# EAGLE schematic assembly_smt_test (EAGLE 9.6.2)
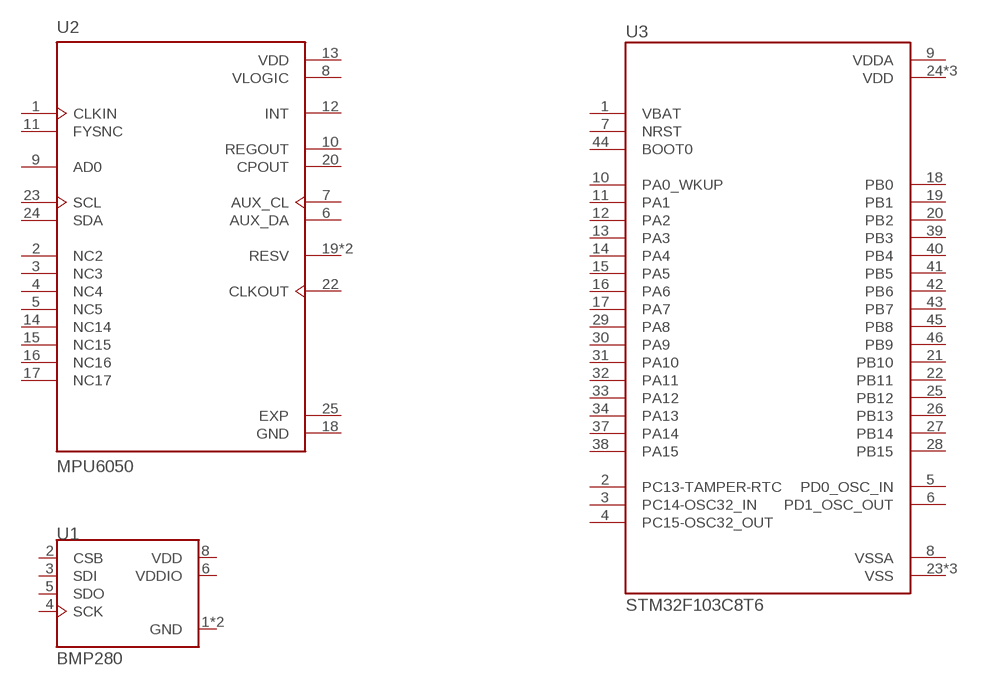
[diagram p0: schematic, sheet 1]

## Parts
U1  BMP280  [XDCR_BMP280]
U2  MPU6050  [IC_MPU6050]
U3  STM32F103C8T6  [QFP50P900X900X160-48N]
Unconnected: U1.2(CSB) U1.3(SDI) U1.4(SCK) U1.5(SDO) U2.1(CLKIN) U2.2(NC2) U2.3(NC3) U2.4(NC4) U2.5(NC5) U2.6(AUX_DA) U2.7(AUX_CL) U2.9(AD0) U2.10(REGOUT) U2.11(FYSNC) U2.12(INT) U2.14(NC14) U2.15(NC15) U2.16(NC16) U2.17(NC17) U2.19(RESV) U2.20(CPOUT) U2.21(RESV) U2.22(CLKOUT) U2.23(SCL) U2.24(SDA) U3.1(VBAT) U3.2(PC13-TAMPER-RTC) U3.3(PC14-OSC32_IN) U3.4(PC15-OSC32_OUT) U3.5(PD0_OSC_IN) U3.6(PD1_OSC_OUT) U3.7(NRST) U3.10(PA0_WKUP) U3.11(PA1) U3.12(PA2) U3.13(PA3) U3.14(PA4) U3.15(PA5) U3.16(PA6) U3.17(PA7) U3.18(PB0) U3.19(PB1) U3.20(PB2) U3.21(PB10) U3.22(PB11) U3.25(PB12) U3.26(PB13) U3.27(PB14) U3.28(PB15) U3.29(PA8) U3.30(PA9) U3.31(PA10) U3.32(PA11) U3.33(PA12) U3.34(PA13) U3.37(PA14) U3.38(PA15) U3.39(PB3) U3.40(PB4) U3.41(PB5) U3.42(PB6) U3.43(PB7) U3.44(BOOT0) U3.45(PB8) U3.46(PB9)

## Power pins joined to a net without a drawn wire
EXP: U2.25(EXP)
GND: U1.1(GND) U1.7(GND) U2.18(GND)
VDD: U1.8(VDD) U2.13(VDD) U3.24(VDD) U3.36(VDD) U3.48(VDD)
VDDA: U3.9(VDDA)
VDDIO: U1.6(VDDIO)
VLOGIC: U2.8(VLOGIC)
VSS: U3.23(VSS) U3.35(VSS) U3.47(VSS)
VSSA: U3.8(VSSA)

## Library data of the parts
U1 = BMP280:BMP280: BMP280 Absolute Barometric Pressure Sensor for Battery Powered Devices 2 x 2.5mm Check prices <https://pricing.snapeda.com/parts/BMP280/Bosch/view-part?ref=eda>; AVAILABILITY: Good; DESCRIPTION: Pressure Sensor 4.35PSI ~ 15.95PSI (30kPa ~ 110kPa) Absolute 16b 8-SMD; MF: Bosch; MP: BMP280; PACKAGE: SMD-8 Bosch Sensortec; PRICE: None; PURCHASE-URL: https://pricing.snapeda.com/search/part/BMP280/?ref=eda
U2 = MPU6050:MPU6050: Is the world’s first integrated 6-axis MotionTracking device that combines a 3-axis gyroscope, 3-axis accelerometer, and a Digital Motion Processor™ (DMP) all in a small 4x4x0.9mm Package.; AVAILABILITY: Unavailable; DESCRIPTION: MPU-6050 - Accelerometer, Gyroscope, 3 Axis Sensor Evaluation Board; MF: TDK InvenSense; MP: MPU6050; PACKAGE: VFQFN-24 TDK InvenSense; PRICE: None
U3 = STM32F103C8T6:STM32F103C8T6: Mainstream Performance line, ARM Cortex-M3 MCU with 64 Kbytes Flash, 72 MHz CPU, motor control, USB and CAN Check prices <https://pricing.snapeda.com/parts/STM32F103C8T6/STMicroelectronics/view-part?ref=eda>; AVAILABILITY: Warning; DESCRIPTION: ARM® Cortex®-M3 STM32F1 Microcontroller IC 32-Bit 72MHz 64KB (64K x 8) FLASH 48-LQFP (7x7); MF: STMicroelectronics; MP: STM32F103C8T6; PACKAGE: LQFP-48 STMicroelectronics; PRICE: None; PURCHASE-URL: https://pricing.snapeda.com/search/part/STM32F103C8T6/?ref=eda